# Altium project sonata-board.PrjPcb (part 4 of 4)

## Sheet sb-sonata-hyperram.SchDoc: Hyperram
size Letter; Organization: NewAE Technology Inc.; Address1: 1083 Queen St., Suite 196; Address2: Halifax; Address3: NS; Address4: Canada B3H 0B2; SheetNumber: 19; SheetTotal: 20; SheetApproved: NO
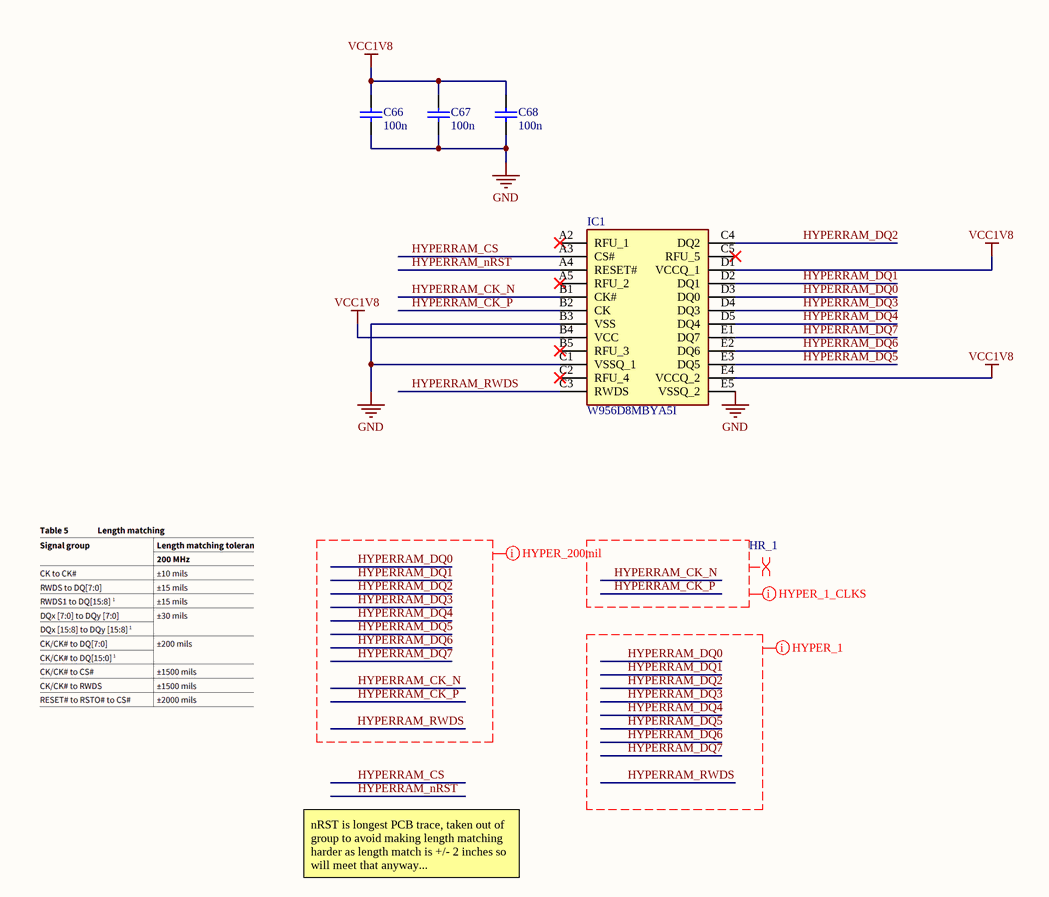
[diagram p18: sb-sonata-hyperram.SchDoc]

### Parts
C66  100n  [CAPC0402_M]
C67  100n  [CAPC0402_M]
C68  100n  [CAPC0402_M]
IC1  W956D8MBYA5I  [BGA24C100P5X5_600X800X120]

### Nets
GND: C66.2 C67.2 C68.2 IC1.B3(VSS) IC1.C1(VSSQ_1) IC1.E5(VSSQ_2)
VCC1V8: C66.1 C67.1 C68.1 IC1.B4(VCC) IC1.D1(VCCQ_1) IC1.E4(VCCQ_2)
HYPERRAM_CK_N: IC1.B1(CK#)
HYPERRAM_CK_P: IC1.B2(CK)
HYPERRAM_CS: IC1.A3(CS#)
HYPERRAM_DQ0: IC1.D3(DQ0)
HYPERRAM_DQ1: IC1.D2(DQ1)
HYPERRAM_DQ2: IC1.C4(DQ2)
HYPERRAM_DQ3: IC1.D4(DQ3)
HYPERRAM_DQ4: IC1.D5(DQ4)
HYPERRAM_DQ5: IC1.E3(DQ5)
HYPERRAM_DQ6: IC1.E2(DQ6)
HYPERRAM_DQ7: IC1.E1(DQ7)
HYPERRAM_nRST: IC1.A4(RESET#)
HYPERRAM_RWDS: IC1.C3(RWDS)

Not connected (* = marked no-connect by the designer): IC1 A2(RFU_1)* A5(RFU_2)* B5(RFU_3)* C2(RFU_4)* C5(RFU_5)*

### Layout directives
net class HYPER_200mil_Length: HYPERRAM_CK_N, HYPERRAM_CK_P, HYPERRAM_DQ0, HYPERRAM_DQ1, HYPERRAM_DQ2, HYPERRAM_DQ3, HYPERRAM_DQ4, HYPERRAM_DQ5, HYPERRAM_DQ6, HYPERRAM_DQ7, HYPERRAM_RWDS
differential pair; differential pair class HR_1: HYPERRAM_CK_N, HYPERRAM_CK_P
net class HYPER_1_Clks: HYPERRAM_CK_N, HYPERRAM_CK_P
net class HYPER_1_Length: HYPERRAM_DQ0, HYPERRAM_DQ1, HYPERRAM_DQ2, HYPERRAM_DQ3, HYPERRAM_DQ4, HYPERRAM_DQ5, HYPERRAM_DQ6, HYPERRAM_DQ7, HYPERRAM_RWDS

### Notes on the sheet
- nRST is longest PCB trace, taken out of group to avoid making length matching harder as length match is +/- 2 inches so will meet that anyway...
- Title:
- Date:
- Rev:
- Time:
- Project:
- Sheet
- of
- License:
- Copyright © NewAE Technology Inc.
- Approved:
- NewAE.com
- File:

### Library data of the parts
C66-C68 = CCHIP-100n-0402: 100n, 0402; Manufacture Part Number 1: CGA2B3X7R1V104K050BB; Component Group: Capacitor; Case-EIA: 0402; Part Number: CCHIP-100n-0402; Footprint: 0402; Pin Count: 2; Value: 100n; Mounting Technology: SMT; Component Kind: Standard; Component Type: Standard; Supplier 1: Digi-Key; Supplier Part Number 1: 445-6901-1-ND
IC1 = W956D8MBYA5I: Integrated Circuit; Manufacturer_Name: Winbond; Datasheet Link: https://www.winbond.com/hq/search-resource-file.jsp?partNo=W956D8MBYA5I&type=datasheet; Height: 1.2mm; Manufacturer_Part_Number: W956D8MBYA5I; Mouser Part Number: 454-W956D8MBYA5I; Mouser Price/Stock: https://www.mouser.co.uk/ProductDetail/Winbond/W956D8MBYA5I?qs=YwPsRIUVAOcvNB%2FM4WBgTQ%3D%3D

## Sheet sb-sonata-lcd.SchDoc: LCD
size Letter; Organization: NewAE Technology Inc.; Address1: 1083 Queen St., Suite 196; Address2: Halifax; Address3: NS; Address4: Canada B3H 0B2; SheetNumber: 20; SheetTotal: 20; SheetApproved: YES
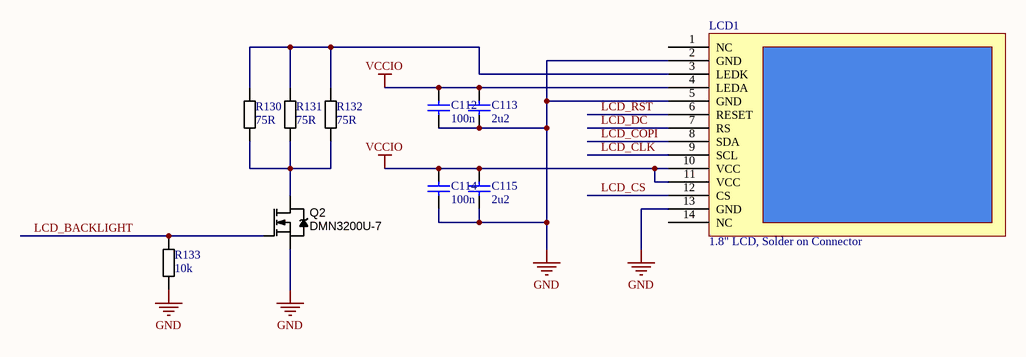
[diagram p19: sb-sonata-lcd.SchDoc]

### Parts
C112  100n  [CAPC0402_M]
C113  2u2  [CAPC0603_M]
C114  100n  [CAPC0402_M]
C115  2u2  [CAPC0603_M]
LCD1  1.8" LCD, Solder on Connector  [ADAFRUIT618]
Q2  DMN3200U-7  [SOT95P245X110-3M]
R130  75R  [RESC2012X70N]
R131  75R  [RESC2012X70N]
R132  75R  [RESC2012X70N]
R133  10k  [RESC1005X40N]

### Nets
GND: C112.2 C113.2 C114.2 C115.2 LCD1.2(GND) LCD1.5(GND) LCD1.13(GND) Q2.2(S) R133.2
VCCIO: C112.1 C113.1 C114.1 C115.1 LCD1.4(LEDA) LCD1.10(VCC) LCD1.11(VCC)  [project net 3V3_FTDI]
LCD_BACKLIGHT: Q2.1(G) R133.1
LCD_CLK: LCD1.9(SCL)
LCD_COPI: LCD1.8(SDA)
LCD_CS: LCD1.12(CS)
LCD_DC: LCD1.7(RS)
LCD_RST: LCD1.6(RESET)
NetLCD1_3: LCD1.3(LEDK) R130.1 R131.1 R132.1
NetQ2_3: Q2.3(D) R130.2 R131.2 R132.2

Not connected (* = marked no-connect by the designer): LCD1 1(NC) 14(NC)

### Notes on the sheet
- Title:
- Date:
- Rev:
- Time:
- Project:
- Sheet
- of
- License:
- Copyright © NewAE Technology Inc.
- Approved:
- NewAE.com
- File:

### Library data of the parts
C112 C114 = CCHIP-100n-0402: as C66 on sheet sb-sonata-hyperram; Part Number: CCHIP-100n-0402; Footprint: 0402; Pin Count: 2; Supplier 1: Digi-Key; Supplier Part Number 1: 445-6901-1-ND; Value: 100n; Mounting Technology: SMT; Component Kind: Standard; Component Type: Standard
C113 C115 = CCHIP-2u2-0603-16V: 2u2, 0603; Manufacture 1: Taiyo Yuden; Manufacture Part Number 1: EMK107BJ225KA-T; Component Group: Capacitor; Case-EIA: 0603; Case-Metric: 1608; Rated Voltage: 16VDC; Part Number: CCHIP-2u2-0603-16V; Footprint: 0603; Pin Count: 2; Supplier 1: Digi-Key; Supplier Part Number 1: 587-1430-1-ND; Value: 2u2; Mounting Technology: SMT; Component Kind: Standard; Component Type: Standard
LCD1 = LCD1.8INCH_ADAFRUIT618: Component Group: Optical; PP Material Stack: 0; Part Number: LCD1.8INCH_ADAFRUIT618; Pin Count: 14; Component Kind: Standard; Component Type: Standard; PP Rotation: 0; PP Rotation1: 0
Q2 = DMN3200U-7: MOSFET N-CH 30V 2.2A SOT23-3; Manufacture 1: Diodes Inc.; Rated Power: 3A; PP Material Stack: 0; Part Number: DMN3200U-7; Component Group: MOSFET; Footprint: SOT23; Manufacture Part Number 1: DMN3200U-7; Pin Count: 3; Supplier 1: Digi-Key; Supplier Part Number 1: DMN3200U-7DICT-ND; Rated Voltage: 30V; Mounting Technology: SMT; RoHS: Yes; Component Kind: Standard; Component Type: Standard; PP Rotation: 0
R130-R132 = RCHIP-75R-0805: 75R res, 0805, 1%, 1/8W; Manufacture 1: Yageo; Manufacture Part Number 1: RC0805FR-0775RL; Component Group: Resistor; Case-EIA: 0805; Rated Power: 0.125W; Rated Voltage: 75VDC; Part Number: RCHIP-75R-0805; Footprint: 0805; Pin Count: 2; Supplier 1: Digi-Key; Supplier Part Number 1: 311-75.0CRCT-ND; Value: 75R; Tolerance: 1%; Mounting Technology: SMT; Temperature Range: -55C to 155C; Component Kind: Standard; Component Type: Standard
R133 = RCHIP-10K-0402: 10k res, 0402, 1%, 1/16W; Manufacture 1: Yageo; Manufacture Part Number 1: RC0402FR-0710KL; Component Group: Resistor; Case-EIA: 0402; Case-Metric: 1005; Rated Power: 0.063W; Rated Voltage: 75VDC; Part Number: RCHIP-10K-0402; Footprint: 0402; Pin Count: 2; Supplier 1: Digi-Key; Supplier Part Number 1: 311-10.0KLRCT-ND; Value: 10k; Tolerance: 1%; Mounting Technology: SMT; Temperature Range: -55C to 155C; Component Kind: Standard; Component Type: Standard

## Nets that join several sheets
3V3_FTDI: sb-sonata-usbhub (R203.1), sb-sonata-headers1 (17 pins), sb-sonata-usbrp (28 pins), sb-sonata-industriaal (7 pins), sb-sonata-debug (20 pins), sb-sonata-led (R20.1 R193.1), sb-sonata-microsd (10 pins), sb-sonata-ethmac (C125.1 C129.1 L9.1), sb-sonata-fpga (15 pins), sb-sonata-fpgaio1 (5 pins), sb-sonata-fpgaio2 (R125.1 R126.1 R127.1 R128.1), sb-sonata-fpgapwr (31 pins), sb-sonata-fpganaalog (C56.1 L3.1 U22.5 U23.5), sb-sonata-analoginput (C100.1 L7.1), sb-sonata-psu (6 pins), sb-sonata-usbphy (C54.1 C55.1 U13.15 U13.16), sb-sonata-lcd (7 pins)
+1V85_XADC_VCC: sb-sonata-fpgapwr (C139.1 U4.H10), sb-sonata-fpganaalog (5 pins)
GND: sb-sonata-usb (15 pins), sb-sonata-usbhub (17 pins), sb-sonata-headers1 (20 pins), sb-sonata-usbrp (30 pins), sb-sonata-industriaal (15 pins), sb-sonata-debug (45 pins), sb-sonata-led (45 pins), sb-sonata-microsd (8 pins), sb-sonata-ethmac (24 pins), sb-sonata-fpga (C141.2 P10.6 Y2.2), sb-sonata-fpgaio1 (C80.2 R213.1 U17.4 U17.9), sb-sonata-fpgapwr (75 pins), sb-sonata-fpganaalog (10 pins), sb-sonata-analoginput (27 pins), sb-sonata-psu (28 pins), sb-sonata-usbphy (15 pins), sb-sonata-hyperram (6 pins), sb-sonata-lcd (9 pins)
VCC1V8: sb-sonata-ethmac (11 pins), sb-sonata-fpgapwr (18 pins), sb-sonata-psu (C31.1 C32.1 U9.2 U9.4), sb-sonata-usbphy (C53.1 R30.2 R32.2 U13.9), sb-sonata-hyperram (6 pins)
VCCINT: sb-sonata-fpgapwr (24 pins), sb-sonata-psu (C37.1 C38.1 L2.2 R9.1)
VCCUSB3V3: sb-sonata-usbhub (11 pins), sb-sonata-psu (5 pins)
232_RX: sb-sonata-industriaal (U7.9), sb-sonata-fpgaio1 (U4.N6)
232_TX: sb-sonata-industriaal (U7.11), sb-sonata-fpgaio1 (U4.P3)
485_DE: sb-sonata-industriaal (U3.3), sb-sonata-fpgaio1 (U4.M4)
485_DI: sb-sonata-industriaal (U3.4), sb-sonata-fpgaio1 (U4.M6)
485_REn: sb-sonata-industriaal (U3.2), sb-sonata-fpgaio1 (U4.N4)
485_RO: sb-sonata-industriaal (U3.1), sb-sonata-fpgaio1 (U4.R2)
AH_AN0: sb-sonata-headers1 (P5.6 P6.1), sb-sonata-analoginput (R75.1 R77.1)
AH_AN1: sb-sonata-headers1 (P5.5), sb-sonata-analoginput (R83.1 R84.1)
AH_AN2: sb-sonata-headers1 (P5.4), sb-sonata-analoginput (R89.1 R91.1)
AH_AN3: sb-sonata-headers1 (P5.3), sb-sonata-analoginput (R97.1 R98.1)
AH_AN4: sb-sonata-headers1 (P5.2), sb-sonata-analoginput (R104.1 R105.1)
AH_AN5: sb-sonata-headers1 (P5.1), sb-sonata-analoginput (R111.1 R112.1)
AH_TMPIO0: sb-sonata-headers1 (P1.1), sb-sonata-fpgaio1 (R188.1B)
AH_TMPIO1: sb-sonata-headers1 (P1.2), sb-sonata-fpgaio1 (R188.2B)
AH_TMPIO2: sb-sonata-headers1 (P1.3), sb-sonata-fpgaio1 (R188.3B)
AH_TMPIO3: sb-sonata-headers1 (P1.4), sb-sonata-fpgaio1 (R188.4B)
AH_TMPIO4: sb-sonata-headers1 (P1.5), sb-sonata-fpgaio1 (R189.1B)
AH_TMPIO5: sb-sonata-headers1 (P1.6), sb-sonata-fpgaio1 (R189.2B)
AH_TMPIO6: sb-sonata-headers1 (P1.7), sb-sonata-fpgaio1 (R189.3B)
AH_TMPIO7: sb-sonata-headers1 (P1.8), sb-sonata-fpgaio1 (R189.4B)
AH_TMPIO8: sb-sonata-headers1 (P4.1), sb-sonata-fpgaio1 (R190.1B)
AH_TMPIO9: sb-sonata-headers1 (P4.2), sb-sonata-fpgaio1 (R190.2B)
AH_TMPIO10: sb-sonata-headers1 (P4.3), sb-sonata-fpgaio1 (R190.3B)
AH_TMPIO11: sb-sonata-headers1 (P4.4), sb-sonata-fpgaio1 (R190.4B)
AH_TMPIO12: sb-sonata-headers1 (P4.5), sb-sonata-fpgaio1 (R191.1B)
AH_TMPIO13: sb-sonata-headers1 (P4.6), sb-sonata-fpgaio1 (R191.2B)
AH_TMPIO14: sb-sonata-headers1 (P11.1), sb-sonata-fpgaio1 (R191.3B)
AH_TMPIO15: sb-sonata-headers1 (P11.3), sb-sonata-fpgaio1 (R191.4B)
AH_TMPIO16: sb-sonata-headers1 (P11.5), sb-sonata-fpgaio1 (R168.2)
AH_TMPIO17: sb-sonata-headers1 (P11.4), sb-sonata-fpgaio1 (R169.2)
ANALOG0_DIGITAL: sb-sonata-fpgaio2 (U4.G13), sb-sonata-fpganaalog (U22.4), sb-sonata-analoginput (R77.2)
ANALOG0_N: sb-sonata-fpganaalog (U4.C5), sb-sonata-analoginput (C98.2 R81.2)
ANALOG0_P: sb-sonata-fpganaalog (U4.C6), sb-sonata-analoginput (C98.1 R79.2)
ANALOG1_DIGITAL: sb-sonata-fpgaio2 (U4.D14), sb-sonata-fpganaalog (U22.6), sb-sonata-analoginput (R83.2)
ANALOG1_N: sb-sonata-fpganaalog (U4.B6), sb-sonata-analoginput (C103.2 R90.2)
ANALOG1_P: sb-sonata-fpganaalog (U4.B7), sb-sonata-analoginput (C103.1 R86.2)
ANALOG2_DIGITAL: sb-sonata-fpgaio2 (U4.C14), sb-sonata-fpganaalog (U22.3), sb-sonata-analoginput (R89.2)
ANALOG2_N: sb-sonata-fpganaalog (U4.A5), sb-sonata-analoginput (C104.2 R96.2)
ANALOG2_P: sb-sonata-fpganaalog (U4.A6), sb-sonata-analoginput (C104.1 R93.2)
ANALOG3_DIGITAL: sb-sonata-fpgaio2 (U4.C9), sb-sonata-fpganaalog (U22.1), sb-sonata-analoginput (R97.2)
ANALOG3_N: sb-sonata-fpganaalog (U4.E5), sb-sonata-analoginput (C105.2 R103.2)
ANALOG3_P: sb-sonata-fpganaalog (U4.E6), sb-sonata-analoginput (C105.1 R100.2)
ANALOG4_DIGITAL: sb-sonata-fpgaio2 (U4.B9), sb-sonata-fpganaalog (U23.4), sb-sonata-analoginput (R104.2)
ANALOG4_N: sb-sonata-fpganaalog (U4.B4), sb-sonata-analoginput (C106.2 R110.2)
ANALOG4_P: sb-sonata-fpganaalog (U4.C4), sb-sonata-analoginput (C106.1 R107.2)
ANALOG5_DIGITAL: sb-sonata-fpgaio2 (U4.B8), sb-sonata-fpganaalog (U23.6), sb-sonata-analoginput (R111.2)
ANALOG5_N: sb-sonata-fpganaalog (U4.A3), sb-sonata-analoginput (C107.2 R117.2)
ANALOG5_P: sb-sonata-fpganaalog (U4.A4), sb-sonata-analoginput (C107.1 R114.2)
APPSPI_CLK: sb-sonata-fpgaio1 (R52.2), sb-sonata-fpgaio2 (U4.A8)
APPSPI_CS: sb-sonata-fpgaio1 (R50.2), sb-sonata-fpgaio2 (U4.D10)
APPSPI_D0: sb-sonata-fpgaio1 (R47.1), sb-sonata-fpgaio2 (U4.C11)
APPSPI_D1: sb-sonata-fpgaio1 (R48.1), sb-sonata-fpgaio2 (U4.C10)
APPSPI_D2: sb-sonata-fpgaio1 (R49.1), sb-sonata-fpgaio2 (U4.A10)
APPSPI_D3: sb-sonata-fpgaio1 (R51.1), sb-sonata-fpgaio2 (U4.A9)
CHA_TCK: sb-sonata-debug (U5.16), sb-sonata-fpga (SW1.3)
CHA_TDI: sb-sonata-debug (U5.17), sb-sonata-fpga (SW1.1)
CHA_TDO: sb-sonata-debug (U5.18), sb-sonata-fpga (SW1.2)
CHA_TMS: sb-sonata-debug (U5.19), sb-sonata-fpga (SW1.4)
CHC_RXD: sb-sonata-headers1 (P12.3), sb-sonata-debug (U5.39)
CHC_TXD: sb-sonata-headers1 (P12.1), sb-sonata-debug (U5.38)
CHD_RXD: sb-sonata-headers1 (P12.7), sb-sonata-debug (U5.52)
CHD_TXD: sb-sonata-headers1 (P12.5), sb-sonata-debug (U5.48)
CHERIERR0: sb-sonata-debug (SW2.10), sb-sonata-led (R139.1), sb-sonata-fpgaio1 (U4.K6)
CHERIERR1: sb-sonata-debug (SW2.9), sb-sonata-led (R141.1), sb-sonata-fpgaio1 (U4.L1)
CHERIERR2: sb-sonata-led (R143.1), sb-sonata-fpgaio1 (U4.M1)
CHERIERR3: sb-sonata-led (R145.1), sb-sonata-fpgaio1 (U4.K3)
CHERIERR4: sb-sonata-led (R146.1), sb-sonata-fpgaio1 (U4.L3)
CHERIERR5: sb-sonata-led (R148.1), sb-sonata-fpgaio1 (U4.N2)
CHERIERR6: sb-sonata-led (R150.1), sb-sonata-fpgaio1 (U4.N1)
CHERIERR7: sb-sonata-led (R152.1), sb-sonata-fpgaio1 (U4.M3)
CHERIERR8: sb-sonata-led (R154.1), sb-sonata-fpgaio1 (U4.M2)
ETHAVCC: sb-sonata-industriaal (C120.1 J3.4 J3.5), sb-sonata-ethmac (C126.1 C130.1 L9.2 U6.16)
ETHCLK: sb-sonata-ethmac (R124.1), sb-sonata-fpga (R123.2)
ETHMAC_CIPO: sb-sonata-ethmac (U6.27), sb-sonata-fpganaalog (U4.D4)
ETHMAC_COPI: sb-sonata-ethmac (U6.31), sb-sonata-fpganaalog (U4.D5)
ETHMAC_CS: sb-sonata-ethmac (U6.26), sb-sonata-fpganaalog (U4.H5)
ETHMAC_INTR: sb-sonata-ethmac (R211.2 U6.3), sb-sonata-fpganaalog (U4.H6)
ETHMAC_LED0: sb-sonata-industriaal (R136.1), sb-sonata-ethmac (U6.1)
ETHMAC_LED1: sb-sonata-industriaal (R137.1), sb-sonata-ethmac (U6.32)
ETHMAC_RST: sb-sonata-ethmac (U6.19), sb-sonata-fpganaalog (U4.J5)
ETHMAC_RX_N: sb-sonata-industriaal (J3.6 R204.2), sb-sonata-ethmac (U6.12)
ETHMAC_RX_P: sb-sonata-industriaal (J3.3 R198.2), sb-sonata-ethmac (U6.11)
ETHMAC_SCLK: sb-sonata-ethmac (U6.28), sb-sonata-fpganaalog (U4.E3)
ETHMAC_TX_N: sb-sonata-industriaal (J3.2 R197.2), sb-sonata-ethmac (U6.15)
ETHMAC_TX_P: sb-sonata-industriaal (J3.1 R196.2), sb-sonata-ethmac (U6.14)
FPGA_CCLK: sb-sonata-usbrp (R65.1), sb-sonata-fpga (U4.E9)
FPGA_DONE: sb-sonata-usbrp (U11.9), sb-sonata-fpga (R134.2 U4.P10)
FPGA_INITB: sb-sonata-usbrp (U11.11), sb-sonata-fpga (R5.2 U4.P7)
FPGA_PGMB: sb-sonata-usbrp (U11.12), sb-sonata-fpga (R6.2 U4.P9)
FPGAIO_TURBO: sb-sonata-fpgaio1 (U4.T4), sb-sonata-psu (SW6.2)
FTDI_N: sb-sonata-usbhub (U12.2), sb-sonata-debug (U5.7)
FTDI_NRST: sb-sonata-usbhub (R73.2), sb-sonata-debug (R42.2)
FTDI_P: sb-sonata-usbhub (U12.3), sb-sonata-debug (U5.8)
HYPERRAM_CK_N: sb-sonata-fpganaalog (U4.G2), sb-sonata-hyperram (IC1.B1)
HYPERRAM_CK_P: sb-sonata-fpganaalog (U4.H2), sb-sonata-hyperram (IC1.B2)
HYPERRAM_CS: sb-sonata-fpganaalog (U4.J2), sb-sonata-hyperram (IC1.A3)
HYPERRAM_DQ0: sb-sonata-fpganaalog (U4.B1), sb-sonata-hyperram (IC1.D3)
HYPERRAM_DQ1: sb-sonata-fpganaalog (U4.E2), sb-sonata-hyperram (IC1.D2)
HYPERRAM_DQ2: sb-sonata-fpganaalog (U4.H1), sb-sonata-hyperram (IC1.C4)
HYPERRAM_DQ3: sb-sonata-fpganaalog (U4.A1), sb-sonata-hyperram (IC1.D4)
HYPERRAM_DQ4: sb-sonata-fpganaalog (U4.E1), sb-sonata-hyperram (IC1.D5)
HYPERRAM_DQ5: sb-sonata-fpganaalog (U4.B2), sb-sonata-hyperram (IC1.E3)
HYPERRAM_DQ6: sb-sonata-fpganaalog (U4.C1), sb-sonata-hyperram (IC1.E2)
HYPERRAM_DQ7: sb-sonata-fpganaalog (U4.D2), sb-sonata-hyperram (IC1.E1)
HYPERRAM_nRST: sb-sonata-fpganaalog (U4.C2), sb-sonata-hyperram (IC1.A4)
HYPERRAM_RWDS: sb-sonata-fpganaalog (U4.F1), sb-sonata-hyperram (IC1.C3)
LCD_BACKLIGHT: sb-sonata-fpgaio1 (U4.N5), sb-sonata-lcd (Q2.1 R133.1)
LCD_CLK: sb-sonata-fpgaio1 (U4.R5), sb-sonata-lcd (LCD1.9)
LCD_COPI: sb-sonata-fpgaio1 (U4.R3), sb-sonata-lcd (LCD1.8)
LCD_CS: sb-sonata-fpgaio1 (U4.P5), sb-sonata-lcd (LCD1.12)
LCD_DC: sb-sonata-fpgaio1 (U4.U4), sb-sonata-lcd (LCD1.7)
LCD_RST: sb-sonata-fpgaio1 (U4.R6), sb-sonata-lcd (LCD1.6)
LED_BOOTOK: sb-sonata-led (R158.1), sb-sonata-fpgaio1 (U4.L5)
LED_CHERI: sb-sonata-led (R155.1), sb-sonata-fpgaio1 (U4.L4)
LED_HALTED: sb-sonata-led (R159.1), sb-sonata-fpgaio1 (U4.L6)
LED_LEGACY: sb-sonata-led (R157.1), sb-sonata-fpgaio1 (U4.K5)
MAINCLK: sb-sonata-fpga (R122.2), sb-sonata-fpgaio1 (U4.P15)
MB0: sb-sonata-headers1 (P6.2), sb-sonata-fpgaio1 (R178.1B)
MB1: sb-sonata-headers1 (P6.3), sb-sonata-fpgaio1 (R178.2B)
MB2: sb-sonata-headers1 (P6.4), sb-sonata-fpgaio1 (R178.3B)
MB3: sb-sonata-headers1 (P6.5), sb-sonata-fpgaio1 (R178.4B)
MB4: sb-sonata-headers1 (P6.6), sb-sonata-fpgaio1 (R180.1B)
MB5: sb-sonata-headers1 (P7.6 R209.2), sb-sonata-fpgaio1 (R180.2B)
MB6: sb-sonata-headers1 (P7.5 R208.2), sb-sonata-fpgaio1 (R180.3B)
MB7: sb-sonata-headers1 (P7.4), sb-sonata-fpgaio1 (R180.4B)
MB8: sb-sonata-headers1 (P7.3), sb-sonata-fpgaio1 (R184.1B)
MB9: sb-sonata-headers1 (P7.2), sb-sonata-fpgaio1 (R184.2B)
MB10: sb-sonata-headers1 (P7.1), sb-sonata-fpgaio1 (R184.3B)
MICROSD_CLK: sb-sonata-microsd (R162.1 SD1.5), sb-sonata-fpgaio1 (U4.U6)
MICROSD_CMD: sb-sonata-microsd (R163.1 SD1.3), sb-sonata-fpgaio1 (U4.R8)
MICROSD_DAT0: sb-sonata-microsd (R161.1 SD1.7), sb-sonata-fpgaio1 (U4.V4)
MICROSD_DAT1: sb-sonata-microsd (R160.1 SD1.8), sb-sonata-fpgaio1 (U4.R7)
MICROSD_DAT2: sb-sonata-microsd (R165.1 SD1.1), sb-sonata-fpgaio1 (U4.V5)
MICROSD_DAT3: sb-sonata-microsd (R164.1 SD1.2), sb-sonata-fpgaio1 (U4.T8)
MICROSD_DET: sb-sonata-microsd (R166.1 SD1.9), sb-sonata-fpganaalog (U4.B3)
NAVSW_0: sb-sonata-led (SW8.1), sb-sonata-fpganaalog (U4.F5)
NAVSW_1: sb-sonata-led (SW8.4), sb-sonata-fpganaalog (U4.D8)
NAVSW_2: sb-sonata-led (SW8.2), sb-sonata-fpganaalog (U4.C7)
NAVSW_3: sb-sonata-led (SW8.3), sb-sonata-fpganaalog (U4.E7)
NAVSW_4: sb-sonata-led (SW8.6), sb-sonata-fpganaalog (U4.D7)
NRST: sb-sonata-headers1 (P2.6), sb-sonata-usbrp (U11.28), sb-sonata-debug (J4.10 J5.15 SW2.12), sb-sonata-led (R20.2 SW5.2), sb-sonata-fpgaio1 (U4.T5)
PMOD0_1: sb-sonata-headers1 (PMOD0.1), sb-sonata-fpgaio2 (R174.1B)
PMOD0_2: sb-sonata-headers1 (PMOD0.2), sb-sonata-fpgaio2 (R174.2B)
PMOD0_3: sb-sonata-headers1 (PMOD0.3), sb-sonata-fpgaio2 (R174.3B)
PMOD0_4: sb-sonata-headers1 (PMOD0.4), sb-sonata-fpgaio2 (R174.4B)
PMOD0_5: sb-sonata-headers1 (PMOD0.7), sb-sonata-fpgaio2 (R176.1B)
PMOD0_6: sb-sonata-headers1 (PMOD0.8), sb-sonata-fpgaio2 (R176.2B)
PMOD0_7: sb-sonata-headers1 (PMOD0.9), sb-sonata-fpgaio2 (R176.3B)
PMOD0_8: sb-sonata-headers1 (PMOD0.10), sb-sonata-fpgaio2 (R176.4B)
PMOD1_1: sb-sonata-headers1 (PMOD1.1), sb-sonata-fpgaio2 (R172.1B)
PMOD1_2: sb-sonata-headers1 (PMOD1.2), sb-sonata-fpgaio2 (R172.2B)
PMOD1_3: sb-sonata-headers1 (PMOD1.3), sb-sonata-fpgaio2 (R172.3B)
PMOD1_4: sb-sonata-headers1 (PMOD1.4), sb-sonata-fpgaio2 (R172.4B)
PMOD1_5: sb-sonata-headers1 (PMOD1.7), sb-sonata-fpgaio2 (R173.1B)
PMOD1_6: sb-sonata-headers1 (PMOD1.8), sb-sonata-fpgaio2 (R173.2B)
PMOD1_7: sb-sonata-headers1 (PMOD1.9), sb-sonata-fpgaio2 (R173.3B)
PMOD1_8: sb-sonata-headers1 (PMOD1.10), sb-sonata-fpgaio2 (R173.4B)
PMODC_1: sb-sonata-headers1 (P8.1), sb-sonata-fpgaio2 (R194.4B)
PMODC_2: sb-sonata-headers1 (P8.2), sb-sonata-fpgaio2 (R186.2)
PMODC_3: sb-sonata-headers1 (P8.3), sb-sonata-fpgaio2 (R187.2)
PMODC_4: sb-sonata-headers1 (P8.4), sb-sonata-fpgaio2 (R194.1B)
PMODC_5: sb-sonata-headers1 (P8.5), sb-sonata-fpgaio2 (R194.2B)
PMODC_6: sb-sonata-headers1 (P8.6), sb-sonata-fpgaio2 (R194.3B)
PWRIN_5V: sb-sonata-usb (5 pins), sb-sonata-headers1 (5 pins), sb-sonata-led (R19.2), sb-sonata-psu (12 pins), sb-sonata-usbphy (R41.2)
QSPI_CS: sb-sonata-usbrp (R57.1), sb-sonata-fpgaio1 (R50.1 U17.1)
QSPI_D0: sb-sonata-usbrp (R60.1), sb-sonata-fpgaio1 (R47.2 U17.5)
QSPI_D1: sb-sonata-usbrp (R55.1), sb-sonata-fpgaio1 (R48.2 U17.2)
QSPI_D2: sb-sonata-usbrp (R61.1), sb-sonata-fpgaio1 (R46.2 R49.2 U17.3)
QSPI_D3: sb-sonata-usbrp (R63.1), sb-sonata-fpgaio1 (R45.2 R51.2 U17.7)
QSPI_SCLK: sb-sonata-usbrp (R59.1), sb-sonata-fpgaio1 (R52.1 U17.6)
RGBLED0: sb-sonata-led (Q3.1 R193.2 R205.1 R210.1), sb-sonata-fpgaio2 (U4.D9)
RP2040_CLK: sb-sonata-usbrp (R70.1), sb-sonata-fpgaio1 (U4.T14)
RP2040_LED3: sb-sonata-usbrp (U11.29), sb-sonata-led (R156.1)
RP2040_N: sb-sonata-usbhub (U12.4), sb-sonata-usbrp (R58.1)
RP2040_NRST: sb-sonata-usbhub (R74.2), sb-sonata-usbrp (R71.1 U11.26)
RP2040_P: sb-sonata-usbhub (U12.5), sb-sonata-usbrp (R56.1)
RP2040_PREQ: sb-sonata-usbrp (U11.8), sb-sonata-fpgaio1 (R171.2)
RP2040_RGBLED0: sb-sonata-usbrp (U11.18), sb-sonata-led (R210.2)
RP2040_RX: sb-sonata-usbrp (R68.1), sb-sonata-fpgaio1 (U4.M17)
RP2040_SPARE: sb-sonata-usbrp (R69.1), sb-sonata-fpgaio1 (U4.P4)
RP2040_TX: sb-sonata-usbrp (R66.1), sb-sonata-fpgaio1 (U4.K18)
RPH_G0: sb-sonata-headers1 (P3.27), sb-sonata-fpgaio1 (R179.4B)
RPH_G1: sb-sonata-headers1 (P3.28), sb-sonata-fpgaio1 (R183.4B)
RPH_G2_SDA: sb-sonata-headers1 (P3.3 R206.1), sb-sonata-fpgaio1 (R175.3B)
RPH_G3_SCL: sb-sonata-headers1 (P3.5 R207.1), sb-sonata-fpgaio1 (R175.4B)
RPH_G4: sb-sonata-headers1 (P3.7), sb-sonata-fpgaio1 (R177.1B)
RPH_G5: sb-sonata-headers1 (P3.29), sb-sonata-fpgaio1 (R181.1B)
RPH_G6: sb-sonata-headers1 (P3.31), sb-sonata-fpgaio1 (R181.2B)
RPH_G12: sb-sonata-headers1 (P3.32), sb-sonata-fpgaio1 (R185.1B)
RPH_G13: sb-sonata-headers1 (P3.33), sb-sonata-fpgaio1 (R181.3B)
RPH_G16_CE2: sb-sonata-headers1 (P3.36), sb-sonata-fpgaio1 (R185.2B)
RPH_G22: sb-sonata-headers1 (P3.15), sb-sonata-fpgaio1 (R177.4B)
RPH_G23: sb-sonata-headers1 (P3.16), sb-sonata-fpgaio1 (R182.3B)
RPH_G24: sb-sonata-headers1 (P3.18), sb-sonata-fpgaio1 (R182.4B)
RPH_G25: sb-sonata-headers1 (P3.22), sb-sonata-fpgaio1 (R183.1B R212.1 R213.2)
RPH_G26: sb-sonata-headers1 (P3.37), sb-sonata-fpgaio1 (R182.1B)
RPH_G27: sb-sonata-headers1 (P3.13), sb-sonata-fpgaio1 (R177.3B)
RPH_RXD0: sb-sonata-headers1 (P3.10), sb-sonata-fpgaio1 (R175.1B)
RPH_TXD0: sb-sonata-headers1 (P3.8), sb-sonata-fpgaio1 (R175.2B)
SCL0: sb-sonata-headers1 (J1.4 P4.10), sb-sonata-fpgaio1 (R170.2B), sb-sonata-fpgaio2 (R126.2)
SCL1: sb-sonata-headers1 (J7.4), sb-sonata-fpgaio1 (R170.4B), sb-sonata-fpgaio2 (R128.2)
SDA0: sb-sonata-headers1 (J1.3 P4.9), sb-sonata-fpgaio1 (R170.1B), sb-sonata-fpgaio2 (R125.2)
SDA1: sb-sonata-headers1 (J7.3), sb-sonata-fpgaio1 (R170.3B), sb-sonata-fpgaio2 (R127.2)
SELSW0: sb-sonata-led (SW7.1), sb-sonata-fpganaalog (U4.D3)
SELSW1: sb-sonata-led (SW7.2), sb-sonata-fpganaalog (U4.F4)
SELSW2: sb-sonata-led (SW7.4), sb-sonata-fpganaalog (U4.F3)
SER0_RX: sb-sonata-headers1 (P12.2), sb-sonata-fpgaio2 (U4.D18)
SER0_TX: sb-sonata-headers1 (P12.4), sb-sonata-fpgaio2 (U4.C17)
SER1_RX: sb-sonata-headers1 (P12.6), sb-sonata-fpgaio2 (U4.G18)
SER1_TX: sb-sonata-headers1 (P12.8), sb-sonata-fpgaio2 (U4.E18)
USB_N: sb-sonata-usb (J2.A7 J2.B7 U1.2), sb-sonata-usbhub (U12.19)
USB_nSUSPEND: sb-sonata-usbhub (R14.1 U12.17), sb-sonata-psu (SW6.6)
USB_P: sb-sonata-usb (J2.A6 J2.B6 U1.3), sb-sonata-usbhub (U12.20)
USB_VBUS: sb-sonata-usb (6 pins), sb-sonata-usbhub (R12.2 R13.1)
USR_JTAG_TCK: sb-sonata-debug (J4.4 J5.9 J5.11 SW2.16), sb-sonata-fpgaio2 (U4.E15)
USR_JTAG_TDI: sb-sonata-debug (J4.8 J5.5 SW2.15), sb-sonata-fpgaio2 (U4.G17)
USR_JTAG_TDO: sb-sonata-debug (J4.6 J5.13 SW2.14), sb-sonata-fpgaio2 (U4.J14)
USR_JTAG_TMS: sb-sonata-debug (J4.2 J5.7 SW2.13), sb-sonata-fpgaio2 (U4.H15)
USR_JTAG_TRST: sb-sonata-debug (J5.3 SW2.11), sb-sonata-fpgaio2 (U4.C16)
USRLED0: sb-sonata-led (R138.1), sb-sonata-fpgaio2 (U4.B13)
USRLED1: sb-sonata-led (R140.1), sb-sonata-fpgaio2 (U4.B14)
USRLED2: sb-sonata-led (R142.1), sb-sonata-fpgaio2 (U4.C12)
USRLED3: sb-sonata-led (R144.1), sb-sonata-fpgaio2 (U4.B12)
USRLED4: sb-sonata-led (R147.1), sb-sonata-fpgaio2 (U4.B11)
USRLED5: sb-sonata-led (R149.1), sb-sonata-fpgaio2 (U4.A11)
USRLED6: sb-sonata-led (R151.1), sb-sonata-fpgaio2 (U4.F13)
USRLED7: sb-sonata-led (R153.1), sb-sonata-fpgaio2 (U4.F14)
USRSW0: sb-sonata-led (SW4.16), sb-sonata-fpgaio2 (U4.D12)
USRSW1: sb-sonata-led (SW4.15), sb-sonata-fpgaio2 (U4.D13)
USRSW2: sb-sonata-led (SW4.14), sb-sonata-fpgaio2 (U4.B16)
USRSW3: sb-sonata-led (SW4.13), sb-sonata-fpgaio2 (U4.B17)
USRSW4: sb-sonata-led (SW4.12), sb-sonata-fpgaio2 (U4.A15)
USRSW5: sb-sonata-led (SW4.11), sb-sonata-fpgaio2 (U4.A16)
USRSW6: sb-sonata-led (SW4.10), sb-sonata-fpgaio2 (U4.A13)
USRSW7: sb-sonata-led (SW4.9), sb-sonata-fpgaio2 (U4.A14)
USRUSB_OE: sb-sonata-fpganaalog (U4.J3), sb-sonata-usbphy (R30.1 U13.3)
USRUSB_RCV: sb-sonata-fpganaalog (U4.J4), sb-sonata-usbphy (U13.4)
USRUSB_SOFTCN: sb-sonata-fpganaalog (U4.H4), sb-sonata-usbphy (U13.2)
USRUSB_SPD: sb-sonata-fpganaalog (U4.G1), sb-sonata-usbphy (U13.10)
USRUSB_SUS: sb-sonata-fpganaalog (U4.K2), sb-sonata-usbphy (R32.1 U13.7)
USRUSB_V_N: sb-sonata-fpganaalog (U4.F6), sb-sonata-usbphy (U13.6)
USRUSB_V_P: sb-sonata-fpganaalog (U4.G6), sb-sonata-usbphy (U13.5)
USRUSB_VBUSDETECT: sb-sonata-fpganaalog (U4.K1), sb-sonata-usbphy (R23.2 R25.1)
USRUSB_VMO: sb-sonata-fpganaalog (U4.G3), sb-sonata-usbphy (U13.14)
USRUSB_VPO: sb-sonata-fpganaalog (U4.G4), sb-sonata-usbphy (U13.13)
XADC_VREF_N: sb-sonata-fpga (U4.J9), sb-sonata-fpganaalog (C60.2 C140.2 R195.2)
XADC_VREF_P: sb-sonata-fpga (U4.K10), sb-sonata-fpganaalog (C60.1 C140.1 U14.2)

## Assembly variants
Variant of cheriot-test: not fitted J4